# EasyEDA schematic Laser_Sign_Remote.json

## Sheets
1 Sheet_1: TITLE: Laser Sign; REV: 1.0; Date: 2026-07-02; Sheet: 1/1; Drawn By: Photonic Tek; Company: Photonic Tek
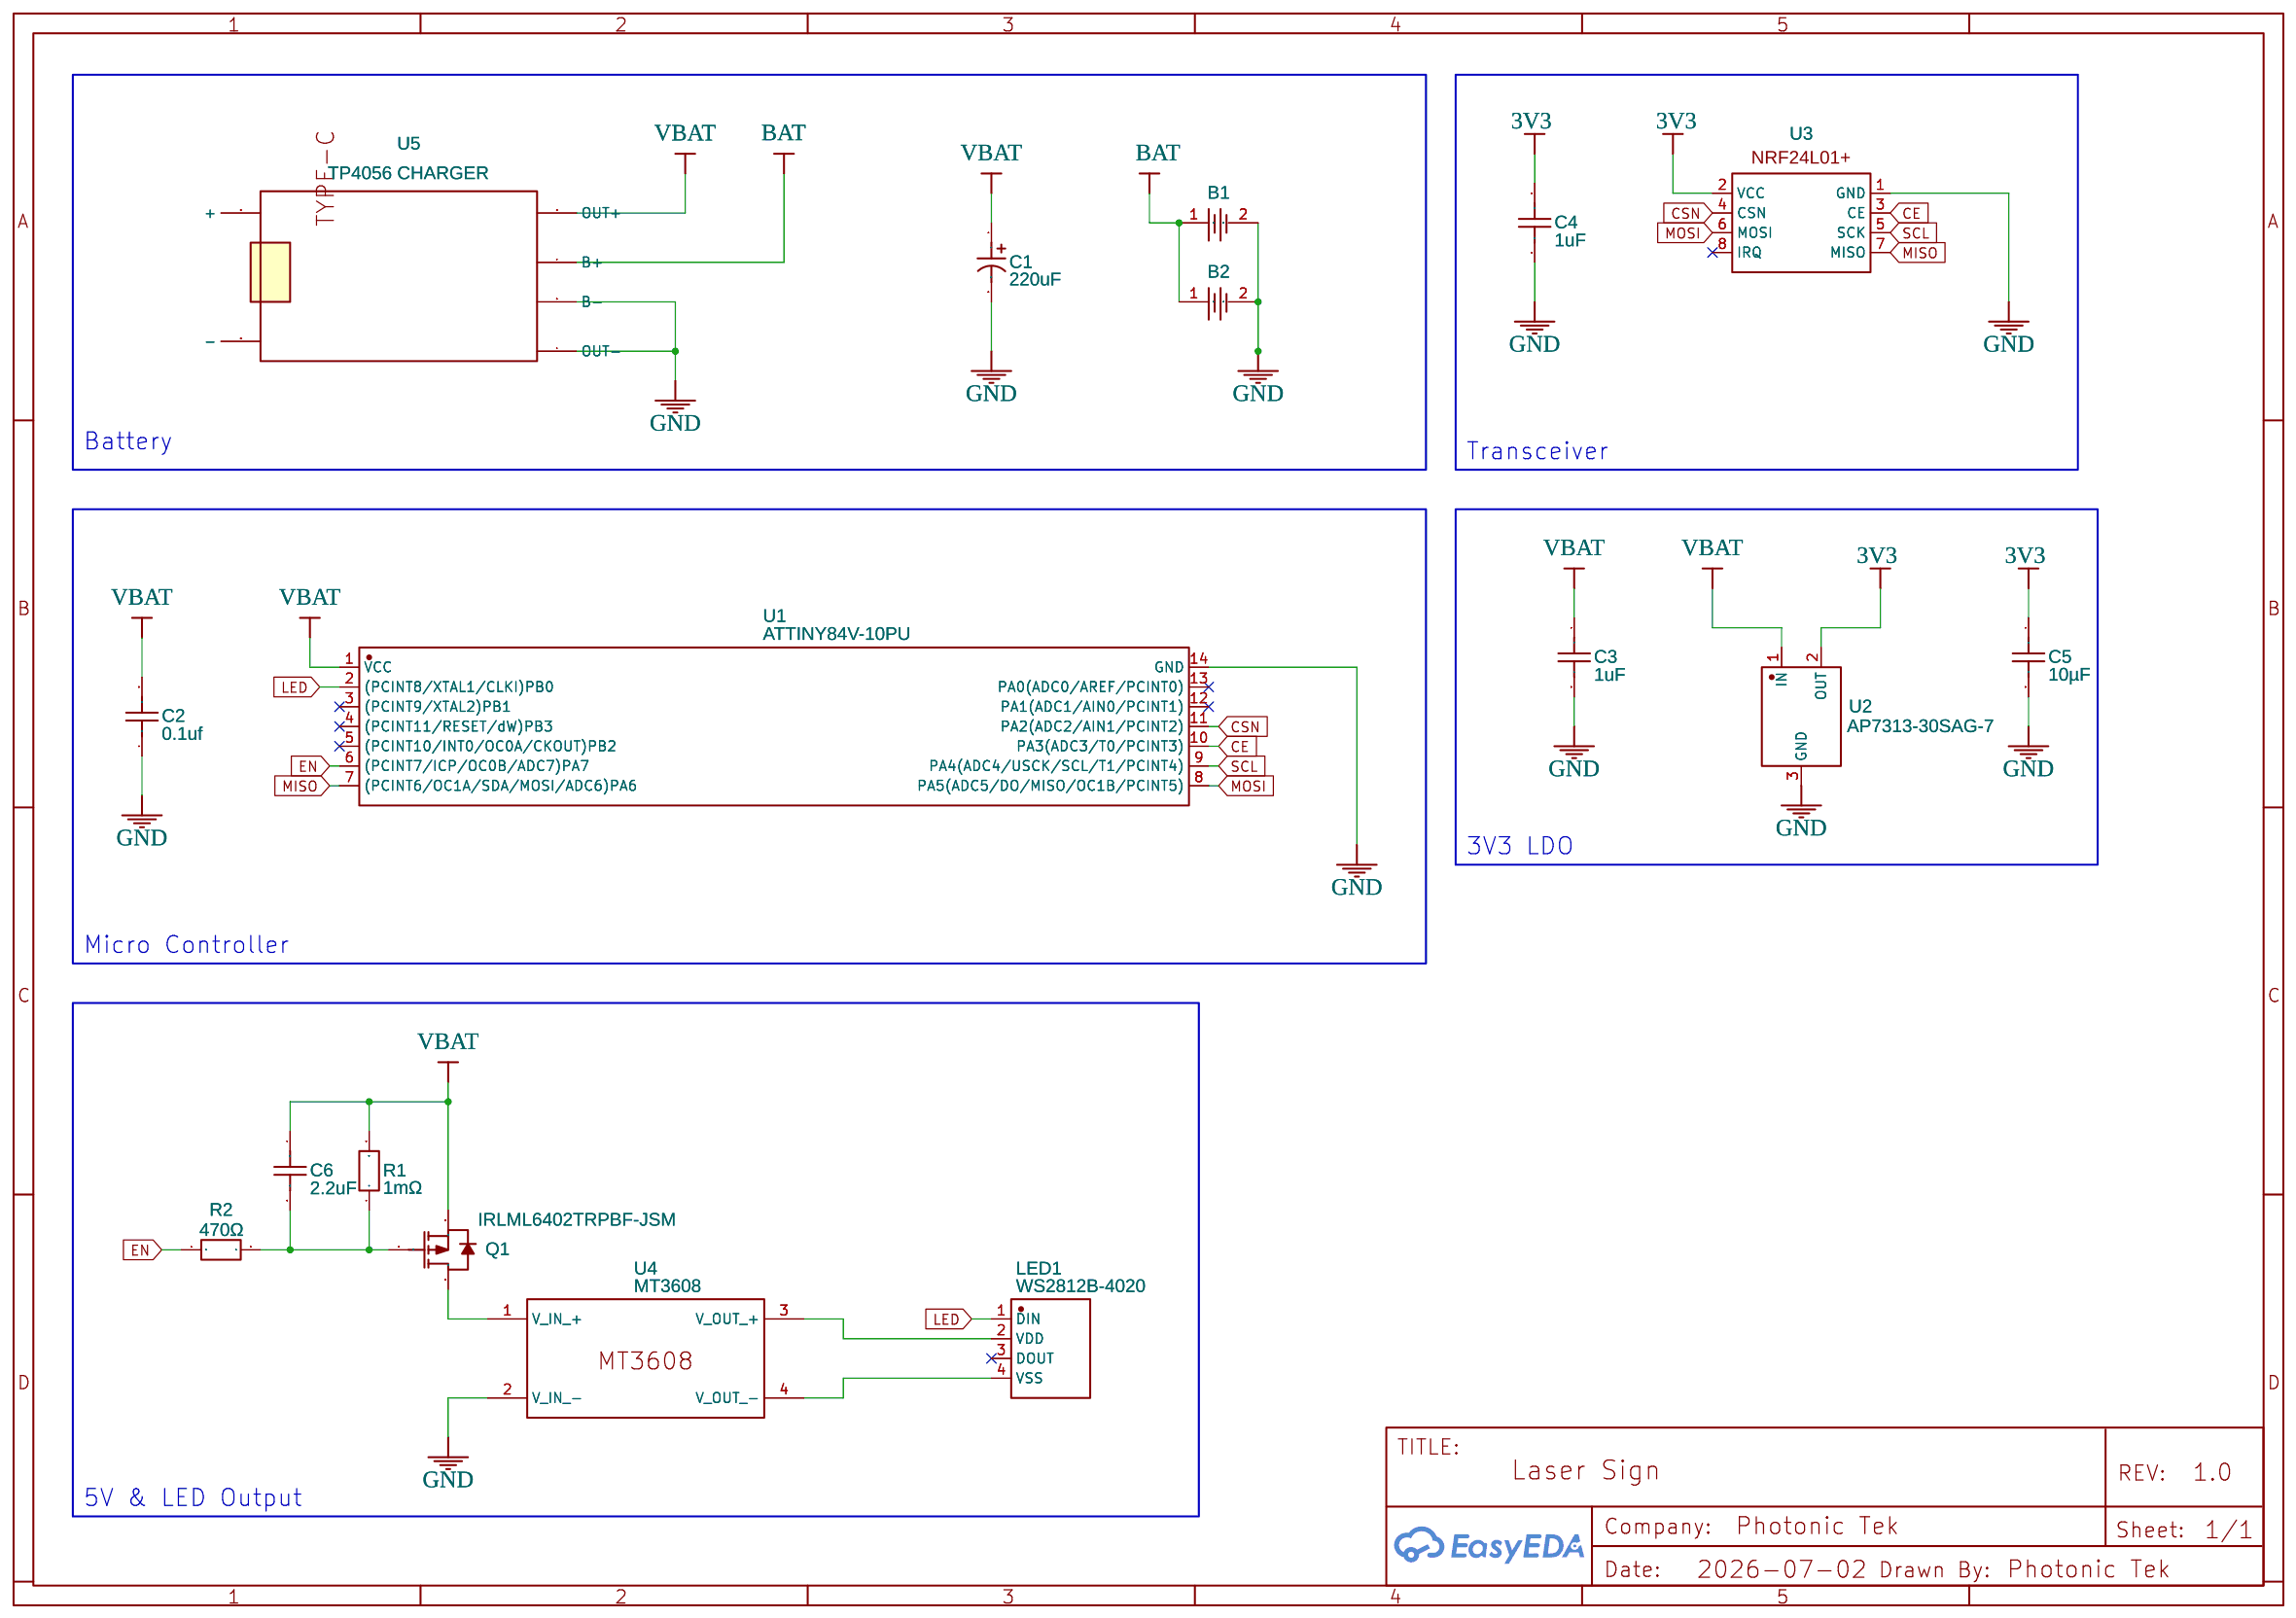
[diagram p0: Sheet_1]
2 Sheet_2: TITLE: Laser Sign Remote; Date: 2026-07-25
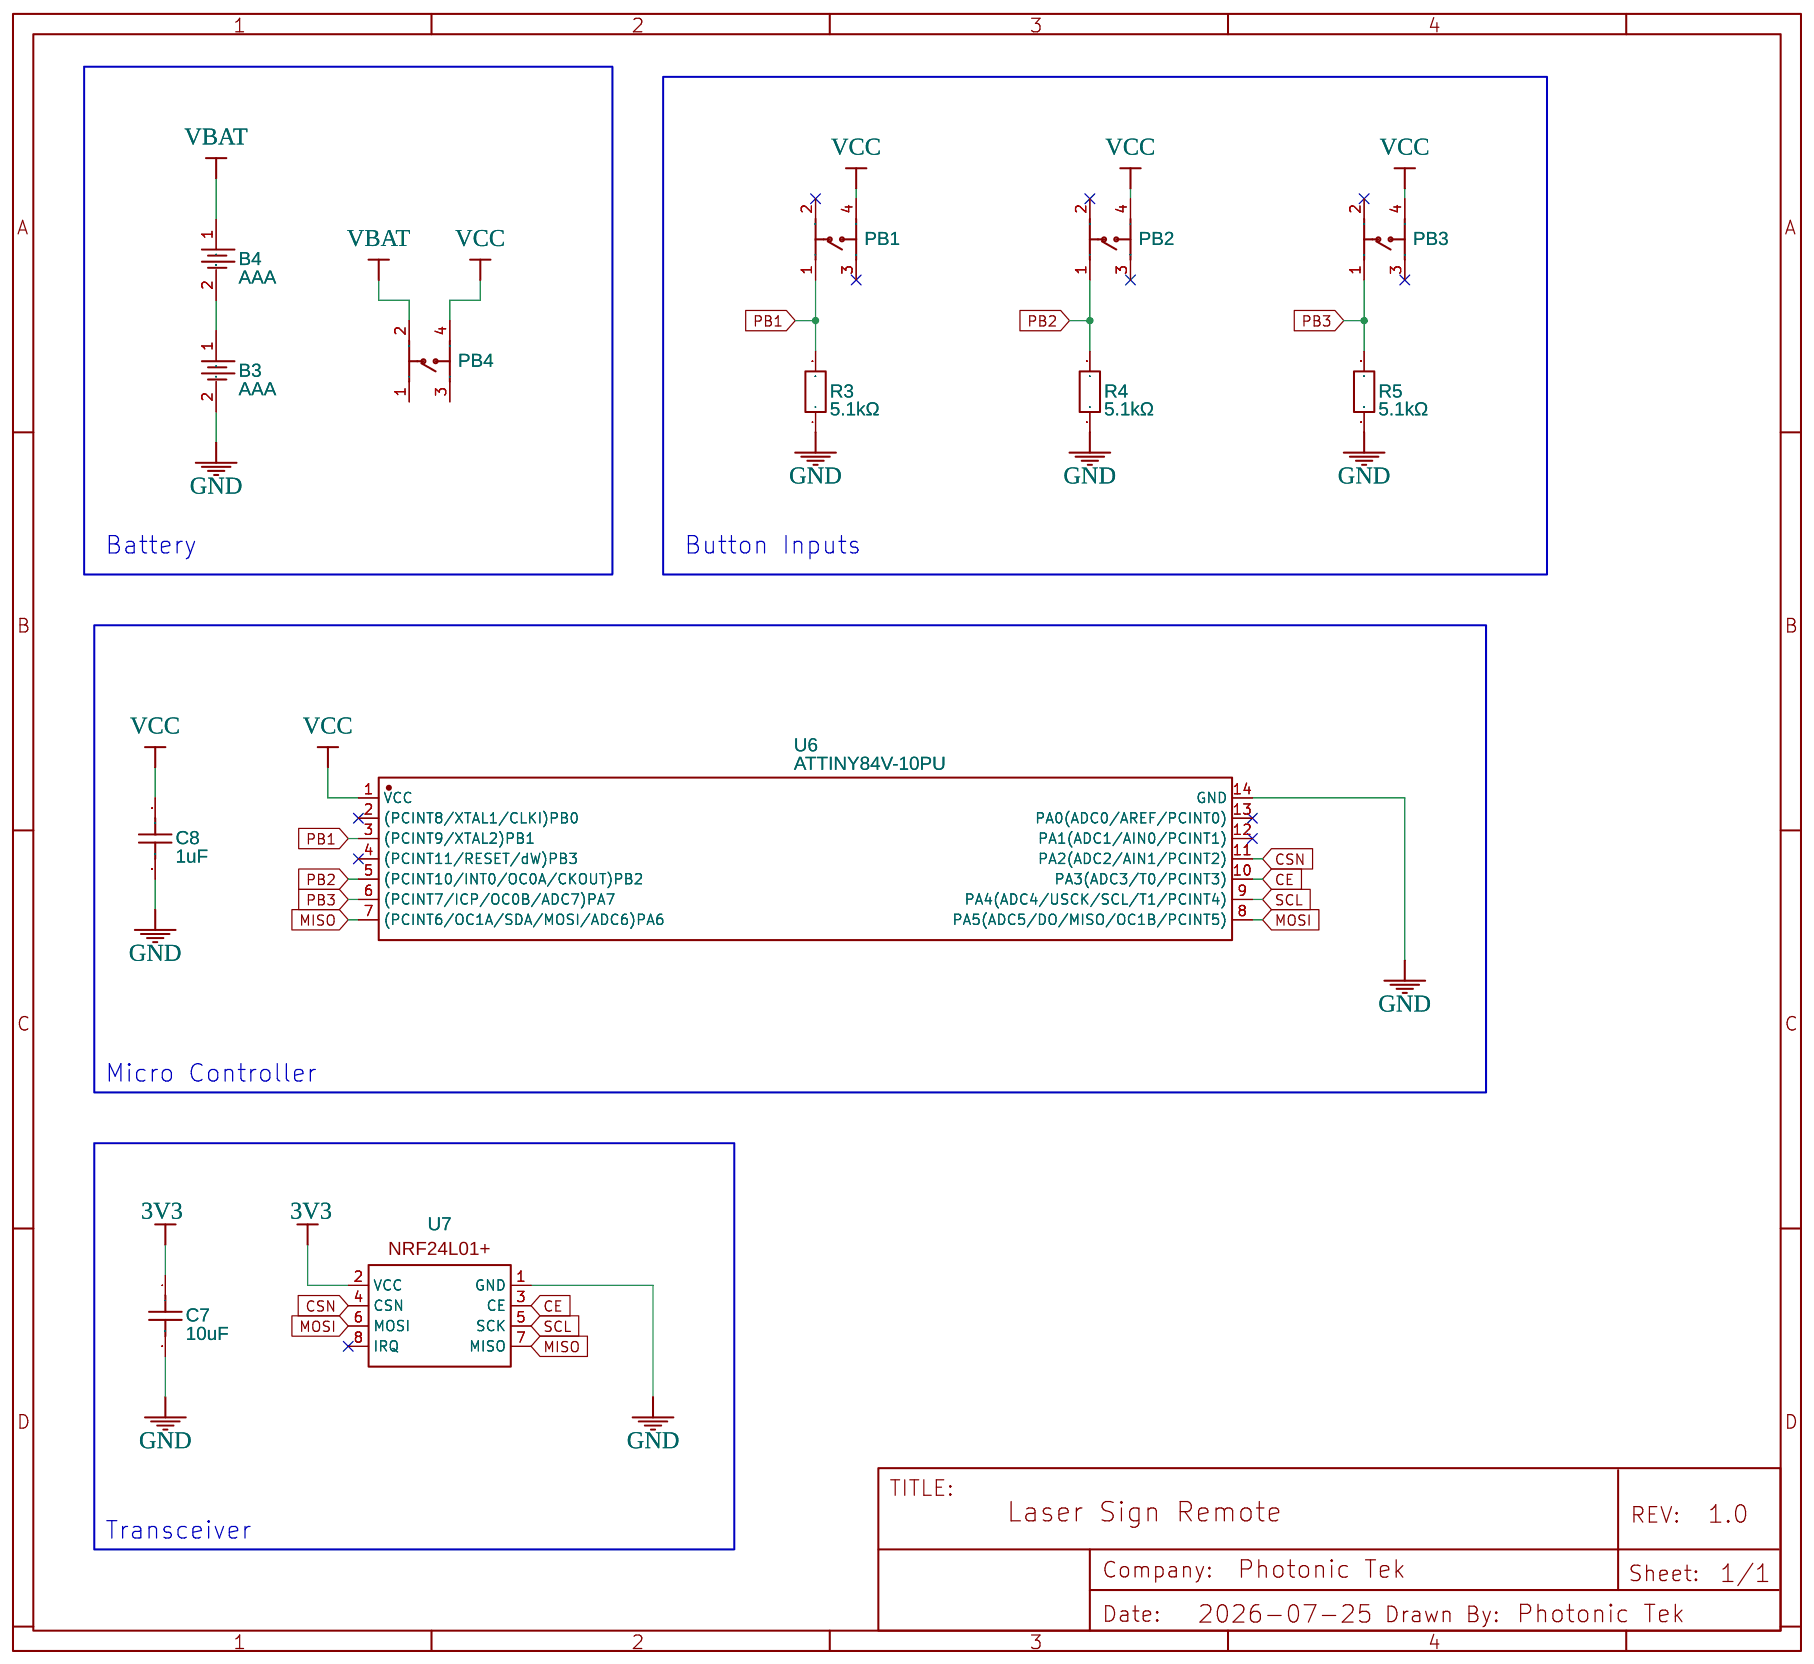
[diagram p1: Sheet_2]

## Parts
sheet Sheet_1
B1  CR1220-2  [BAT-SMD_CR1220-2]
B2  CR1220-2  [BAT-SMD_CR1220-2]
C1  220uF  [CAP-TH_BD10.0-P5.00-D0.6-FD_ERG50V220M10X13]
C2  0.1uf  [0.1UF CAPACITOR]
C3  1uF  [C 0805]
C4  1uF  [C 0805]
C5  10µF  [C0603]
C6  2.2uF  [C 0805]
LED1  WS2812B-4020  [LED-SMD_WS2812B-4020]
Q1  IRLML6402TRPBF-JSM  [SOT-23-3_L2.9-W1.3-P1.90-LS2.4-BR]
R1  1mΩ  [RES-TH_OHMITE_TP810PW1K00JE]
R2  470Ω  [RES-TH_OHMITE_TP810PW1K00JE]
U1  ATTINY84V-10PU  [PDIP-14_L19.7-W6.6-P2.54-LS8.3-BL]
U2  AP7313-30SAG-7  [SOT-23-3_L2.9-W1.3-P1.90-LS2.4-BR]
U3  NRF24L01+  [NRF24L01+]
U4  MT3608  [MT3608]
U5  TP4056 CHARGER  [TP4056-CHARGING-MODULE_TP4056]
sheet Sheet_2
B3  AAA  [BAT-SMD_CR1220-2]
B4  AAA  [BAT-SMD_CR1220-2]
C7  10uF  [C 0805]
C8  1uF  [C 0805]
PB1  TSC005A2526B  [SW-SMD_4P-L5.2-W5.2-P3.70-LS6.4]
PB2  TSC005A2526B  [SW-SMD_4P-L5.2-W5.2-P3.70-LS6.4]
PB3  TSC005A2526B  [SW-SMD_4P-L5.2-W5.2-P3.70-LS6.4]
PB4  TSC005A2526B  [SW-SMD_4P-L5.2-W5.2-P3.70-LS6.4]
R3  5.1kΩ  [R0805]
R4  5.1kΩ  [R0805]
R5  5.1kΩ  [R0805]
U6  ATTINY84V-10PU  [PDIP-14_L19.7-W6.6-P2.54-LS8.3-BL]
U7  NRF24L01+  [NRF24L01+]

## Library data of the parts
B1-B4 = CR1220-2: Supplier: LCSC; Manufacturer: Q&J; image: //image.lceda.cn/szlcsc/C70381.jpg; Supplier Part: C70381
C1 = ERG50V220M10X13: Supplier: LCSC; Supplier Part: C51904472; Manufacturer: JIERR(捷而瑞); JLCPCB Part Class: Extended Part; Contributor: lcsc
C2 = GE CERAMIC CAPACITOR: Contributor: SugarFoot Pedals
C3 C4 C6-C8 = 08053C105JAT2A: Manufacturer: KYOCERA AVX; Supplier: Digi-Key; Supplier Part: 478-10487-1-ND; link: https://www.digikey.ca/en/products/detail/kyocera-avx/08053C105JAT2A/1602174; Contributor: optechalexd
C5 = CL10A106MA8NRNC: Manufacturer: Samsung Electro-Mechanics; Supplier Part: 1276-1869-1-ND; Supplier: Digi-Key; link: https://www.digikey.ca/en/products/detail/samsung-electro-mechanics/CL10A106MA8NRNC/3887527; Contributor: deserresalex; Voltage: 25V; Tolerance: 20%
LED1 = WS2812B-4020: Contributor: LCSC; Supplier: LCSC; Supplier Part: C965557; Manufacturer: worldsemi; JLCPCB Part Class: Extended Part
Q1 = IRLML6402TRPBF-JSM: Supplier: LCSC; Supplier Part: C18190991; Manufacturer: JSMSEMI(杰盛微); JLCPCB Part Class: Extended Part; Contributor: lcsc
R1 R2 = TP810PW10K0JE: Contributor: lcsc; Supplier: LCSC; Supplier Part: C3455433; Manufacturer: Ohmite
U1 U6 = ATTINY84V-10PU: Contributor: LCSC; Supplier: LCSC; Supplier Part: C613474; Manufacturer: null
U2 = AP7313-30SAG-7: Contributor: LCSC; Supplier: LCSC; Supplier Part: C460374; Manufacturer: DIODES(美台); JLCPCB Part Class: Extended Part
U3 U7 = NRF24L01+: Contributor: Barnei Load
U4 = MT3608: Contributor: Vladislav555
U5 = TP4056 CHARGING MODDULE: Manufacturer Part: TP4056; Contributor: zcam29112000
PB1-PB4 = TSC005A2526B: Contributor: LCSC; Supplier: LCSC; Supplier Part: C2888482; Manufacturer: BZCN(博众电气); JLCPCB Part Class: Extended Part
R3-R5 = ERJP06J512V: Contributor: LCSC; Supplier: LCSC; Supplier Part: C543469; Manufacturer: PANASONIC(松下); JLCPCB Part Class: Extended Part

## Nets
3V3: C4.1 C5.1 C7.1 U2.2(OUT) U3.2(VCC) U7.2(VCC)
GND: B1.2 B2.2 B3.2 C1.2 C2.1 C3.2 C4.2 C5.2 C7.2 C8.2 R3.1 R4.1 R5.1 U1.14(GND) U2.3(GND) U3.1(GND) U4.2(V_IN -) U6.14(GND) U7.1(GND)
VBAT: B4.1 C1.1 C2.2 C3.1 C6.1 PB4.2 Q1.2(S) R1.2 U1.1(VCC) U2.1(IN)
VCC: C8.1 PB1.4 PB2.4 PB3.4 PB4.4 U6.1(VCC)
BAT: B1.1 B2.1
CE: U1.10(PA3(ADC3/T0/PCINT3)) U3.3(CE) U6.10(PA3(ADC3/T0/PCINT3)) U7.3(CE)
CSN: U1.11(PA2(ADC2/AIN1/PCINT2)) U3.4(CSN) U6.11(PA2(ADC2/AIN1/PCINT2)) U7.4(CSN)
EN: R2.1 U1.6((PCINT7/ICP/OC0B/ADC7)PA7)
LED: LED1.1(DIN) U1.2((PCINT8/XTAL1/CLKI)PB0)
MISO: U1.7((PCINT6/OC1A/SDA/MOSI/ADC6)PA6) U3.7(MISO) U6.7((PCINT6/OC1A/SDA/MOSI/ADC6)PA6) U7.7(MISO)
MOSI: U1.8(PA5(ADC5/DO/MISO/OC1B/PCINT5)) U3.6(MOSI) U6.8(PA5(ADC5/DO/MISO/OC1B/PCINT5)) U7.6(MOSI)
PB1: PB1.1 R3.2 U6.3((PCINT9/XTAL2)PB1)
PB2: PB2.1 R4.2 U6.5((PCINT10/INT0/OC0A/CKOUT)PB2)
PB3: PB3.1 R5.2 U6.6((PCINT7/ICP/OC0B/ADC7)PA7)
SCL: U1.9(PA4(ADC4/USCK/SCL/T1/PCINT4)) U3.5(SCK) U6.9(PA4(ADC4/USCK/SCL/T1/PCINT4)) U7.5(SCK)
Net-(B3-1): B3.1 B4.2
Net-(C6-2): C6.2 Q1.1(G) R1.1 R2.2
Net-(LED1-2): LED1.2(VDD) U4.3(V_OUT +)
Net-(LED1-4): LED1.4(VSS) U4.4(V_OUT -)
Net-(Q1-3): Q1.3(D) U4.1(V_IN +)

Not connected (* = marked no-connect by the designer): LED1 3(DOUT)*; PB1 2* 3*; PB2 2* 3*; PB3 2* 3*; PB4 1 3; U1 3((PCINT9/XTAL2)PB1)* 4((PCINT11/RESET/dW)PB3)* 5((PCINT10/INT0/OC0A/CKOUT)PB2)* 12(PA1(ADC1/AIN0/PCINT1))* 13(PA0(ADC0/AREF/PCINT0))*; U3 8(IRQ)*; U5 1(B+) 2(B-) 3(OUT+) 4(OUT-) 5(+) 6(-); U6 2((PCINT8/XTAL1/CLKI)PB0)* 4((PCINT11/RESET/dW)PB3)* 12(PA1(ADC1/AIN0/PCINT1))* 13(PA0(ADC0/AREF/PCINT0))*; U7 8(IRQ)*

## Notes on the sheets
sheet 1
- Battery
- Transceiver
- 3V3 LDO
- Micro Controller
- 5V & LED Output
sheet 2
- Battery
- Button Inputs
- Micro Controller
- Transceiver
